# Altium schematic sheet LevelShifting_Isolation.SchDoc
size A4; CompanyName: Technische Hochschule Nürnberg Georg Simon Ohm; Organization: UltraZohm; Address1: Kesslerplatz 12; Address2: 90489 Nürnberg; Address3: GERMANY; SheetNumber: 19; SheetTotal: 36; Website: www.ultrazohm.com
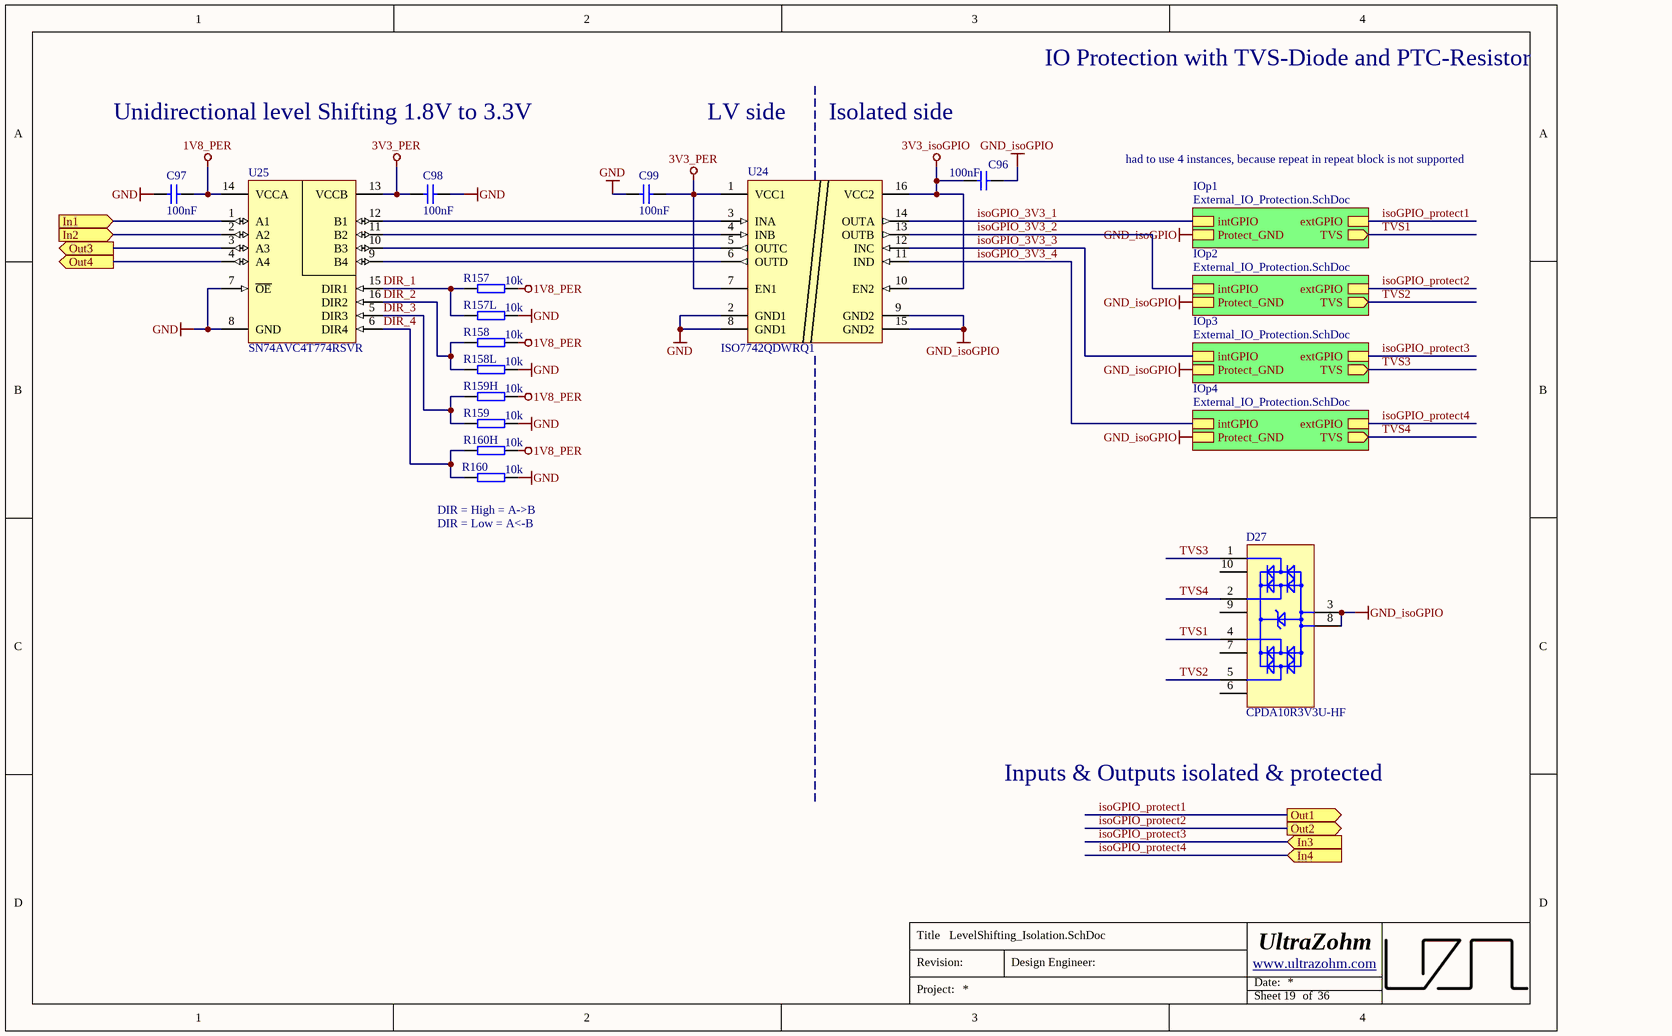
[diagram p0: LevelShifting_Isolation.SchDoc]

## Parts
C96  100nF  [CAPC1608X90N_V]
C97  100nF  [CAPC1608X90N_V]
C98  100nF  [CAPC1608X90N_V]
C99  100nF  [CAPC1608X90N_V]
D27  CPDA10R3V3U-HF  [DFN230X100X55X10N]
R157  10k  [R_0603_TE]
R157L  10k  [R_0603_TE]
R158  10k  [R_0603_TE]
R158L  10k  [R_0603_TE]
R159  10k  [R_0603_TE]
R159H  10k  [R_0603_TE]
R160  10k  [R_0603_TE]
R160H  10k  [R_0603_TE]
U24  ISO7742QDWRQ1  [SOIC127P1030X265-16N]
U25  SN74AVC4T774RSVR  [QFN40P260X180X55-16N]

## Sub-sheets
IOp1 = External_IO_Protection.SchDoc: extGPIO, intGPIO, TVS (out), Protect_GND
IOp2 = External_IO_Protection.SchDoc: extGPIO, intGPIO, TVS (out), Protect_GND
IOp3 = External_IO_Protection.SchDoc: extGPIO, intGPIO, TVS (out), Protect_GND
IOp4 = External_IO_Protection.SchDoc: extGPIO, intGPIO, TVS (out), Protect_GND

## Ports
In1 (in), In2 (in), In3 (in), In4 (in), Out1 (out), Out2 (out), Out3 (out), Out4 (out)

## Nets
1V8_PER: C97.1 R157.2 R158.2 R159H.2 R160H.2 U25.14(VCCA)
3V3_isoGPIO: C96.1 U24.10(EN2) U24.16(VCC2)
3V3_PER: C98.2 C99.2 U24.1(VCC1) U24.7(EN1) U25.13(VCCB)
GND: C97.2 C98.1 C99.1 R157L.2 R158L.2 R159.2 R160.2 U24.2(GND1) U24.8(GND1) U25.7(~{OE}) U25.8(GND)
GND_isoGPIO: C96.2 D27.3 D27.8 U24.9(GND2) U24.15(GND2) ; sheet IOp1/Protect_GND, sheet IOp2/Protect_GND, sheet IOp3/Protect_GND, sheet IOp4/Protect_GND
DIR_1: R157.1 R157L.1 U25.15(DIR1)
DIR_2: R158.1 R158L.1 U25.16(DIR2)
DIR_3: R159.1 R159H.1 U25.5(DIR3)
DIR_4: R160.1 R160H.1 U25.6(DIR4)
In1: U25.1(A1) ; port In1
In2: U25.2(A2) ; port In2
isoGPIO_3V3_1: U24.14(OUTA) ; sheet IOp1/intGPIO
isoGPIO_3V3_2: U24.13(OUTB) ; sheet IOp2/intGPIO
isoGPIO_3V3_3: U24.12(INC) ; sheet IOp3/intGPIO
isoGPIO_3V3_4: U24.11(IND) ; sheet IOp4/intGPIO
isoGPIO_protect1: port Out1, sheet IOp1/extGPIO
isoGPIO_protect2: port Out2, sheet IOp2/extGPIO
isoGPIO_protect3: port In3, sheet IOp3/extGPIO
isoGPIO_protect4: port In4, sheet IOp4/extGPIO
Out3: U25.3(A3) ; port Out3
Out4: U25.4(A4) ; port Out4
TVS1: D27.4 ; sheet IOp1/TVS
TVS2: D27.5 ; sheet IOp2/TVS
TVS3: D27.1 ; sheet IOp3/TVS
TVS4: D27.2 ; sheet IOp4/TVS
NetU24_3: U24.3(INA) U25.12(B1)
NetU24_4: U24.4(INB) U25.11(B2)
NetU24_5: U24.5(OUTC) U25.10(B3)
NetU24_6: U24.6(OUTD) U25.9(B4)

Not connected (* = marked no-connect by the designer): D27 6 7 9 10

## Notes on the sheet
- IO Protection with TVS-Diode and PTC-Resistor
- Unidirectional level Shifting 1.8V to 3.3V
- LV side
- Isolated side
- had to use 4 instances, because repeat in repeat block is not supported
- (near R160) DIR = High = A->B
- (near R160) DIR = Low = A<-B
- Inputs & Outputs isolated & protected
- Title
- Revision:
- Design Engineer:
- Date:
- Project:
- Sheet
- of

## Library data of the parts
C96-C99 = 21382: KON 100nF 50V X7R ±10% SMD BF 1608 (0603); Value: 100n; AN: 21382; Mixed: SMT; Preferred: Yes; Temperature-Range: -55/+125; Tolerance: ±10%; Voltage: 50V; Technology: X7R; Case: 1608 (0603)
D27 = 29054: AN: 29054; Voltage: 3.3V; Mixed: SMT; Temperature-Range: -55/+125; Extra: Diode Array TVS Diode ESD Protection 4-channel; Case: TSLP-9-1; HelpURL: b:\AD\adlib\datasheet\CPDA10R3V3U-HF\; H-ART: CPDA10R3V3U-HF
R157 R157L R158 R158L R159 R159H R160 R160H = UZgen_R_0603_10k: Generic resistor; Manufacturer: UZgen; Tolerance: 1 %; Created from: AGeiger; Value: 10k; Manufacturer Part Number: UZgen_R_0603_10k; PartID: 1; Created On: 02.07.2024 14:34:53; Device Package: 0603; Mounting Type: SMD; Last Updated: 02.07.2024 14:37:16
U24 = 30782: AN: 30782; Mixed: SMT; Temperature-Range: -40/+125; Extra: General Purpose Digital Isolator 5000Vrms 4 Channel 100Mbps 2/2 16-SOIC; Case: SOIC16; HelpURL: b:\AD\adlib\datasheet\TI\ISO774x\; H-ART: ISO7742QDWRQ1; Storage-Temperature: -65/+150(Abs)
U25 = 27170: AN: 27170; Mixed: SMT; Trenz-Stock: Yes; Extra: 4-Bit Dual-Supply Bus Transceiver With Configurable Voltage Translationand 3-Sta; HelpURL: B:\ad\adlib\datasheet\sn74avc4t774; Case: UQFN-16; H-ART: SN74AVC4T774RSVR